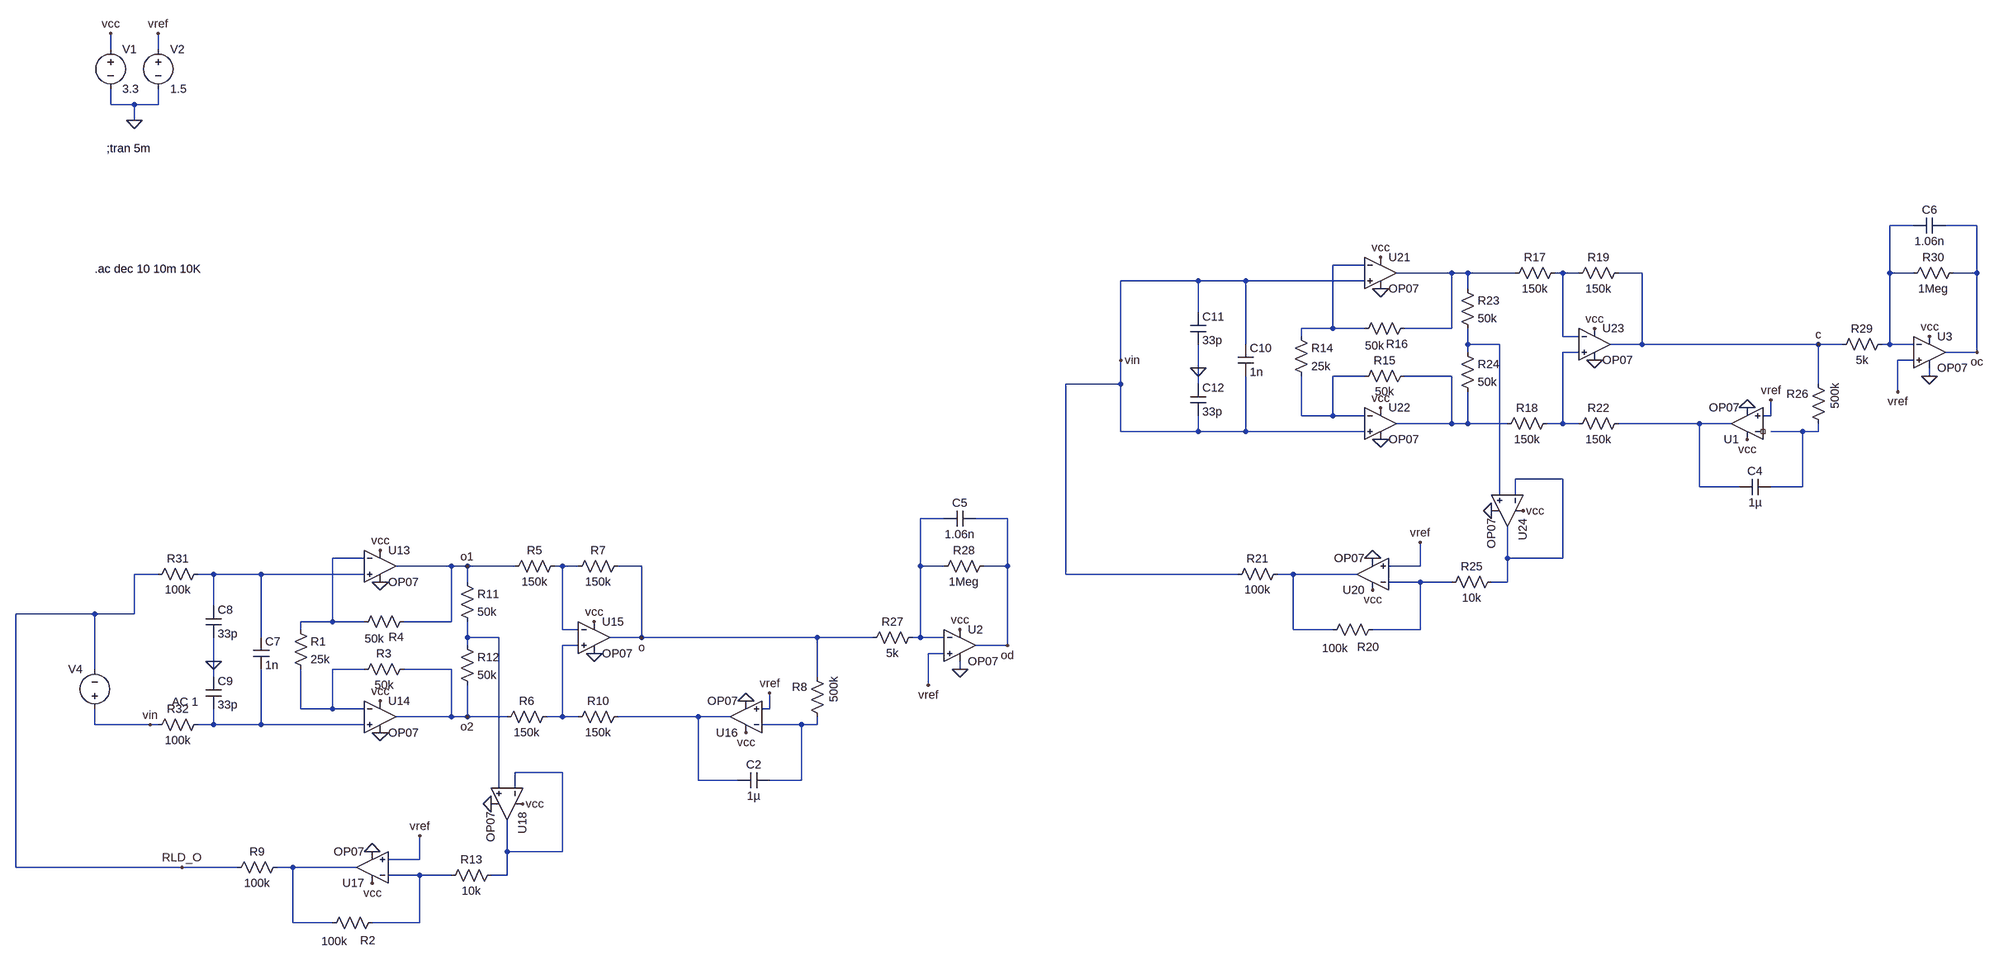
[diagram p0: schematic CMRR - Copy.asc]
CMRR - Copy.asc, the LTspice schematic file:
Version 4
SHEET 1 3136 1104
WIRE -1280 -1120 -1280 -1152
WIRE -1184 -1120 -1184 -1152
WIRE -1280 -1008 -1280 -1040
WIRE -1232 -1008 -1280 -1008
WIRE -1184 -1008 -1184 -1040
WIRE -1184 -1008 -1232 -1008
WIRE -1232 -976 -1232 -1008
WIRE 2976 -624 2928 -624
WIRE 3104 -624 3040 -624
WIRE 1808 -544 1744 -544
WIRE 1984 -528 1872 -528
WIRE 2016 -528 1984 -528
WIRE 2112 -528 2016 -528
WIRE 2208 -528 2192 -528
WIRE 2240 -528 2208 -528
WIRE 2368 -528 2320 -528
WIRE 2928 -528 2928 -624
WIRE 2976 -528 2928 -528
WIRE 3104 -528 3104 -624
WIRE 3104 -528 3056 -528
WIRE 1472 -512 1264 -512
WIRE 1568 -512 1472 -512
WIRE 1808 -512 1568 -512
WIRE 2016 -496 2016 -528
WIRE 1472 -448 1472 -512
WIRE 1744 -416 1744 -544
WIRE 1744 -416 1680 -416
WIRE 1808 -416 1744 -416
WIRE 1984 -416 1984 -528
WIRE 1984 -416 1888 -416
WIRE 1680 -400 1680 -416
WIRE 2208 -400 2208 -528
WIRE 2240 -400 2208 -400
WIRE 1568 -384 1568 -512
WIRE 2016 -384 2016 -416
WIRE 2080 -384 2016 -384
WIRE 2368 -384 2368 -528
WIRE 2368 -384 2304 -384
WIRE 2784 -384 2368 -384
WIRE 2832 -384 2784 -384
WIRE 2928 -384 2928 -528
WIRE 2928 -384 2912 -384
WIRE 2976 -384 2928 -384
WIRE 2016 -368 2016 -384
WIRE 2240 -368 2208 -368
WIRE 3104 -368 3104 -528
WIRE 3104 -368 3040 -368
WIRE 1264 -352 1264 -512
WIRE 2976 -352 2944 -352
WIRE 1472 -336 1472 -384
WIRE 1808 -320 1744 -320
WIRE 1984 -320 1888 -320
WIRE 3008 -320 3008 -336
WIRE 1264 -304 1264 -352
WIRE 1264 -304 1088 -304
WIRE 1472 -304 1472 -336
WIRE 2784 -304 2784 -384
WIRE 2944 -288 2944 -352
WIRE 1680 -240 1680 -320
WIRE 1744 -240 1744 -320
WIRE 1744 -240 1680 -240
WIRE 1808 -240 1744 -240
WIRE 2688 -240 2688 -272
WIRE 2688 -240 2672 -240
WIRE 1984 -224 1984 -320
WIRE 1984 -224 1872 -224
WIRE 2016 -224 2016 -288
WIRE 2016 -224 1984 -224
WIRE 2096 -224 2016 -224
WIRE 2208 -224 2208 -368
WIRE 2208 -224 2176 -224
WIRE 2240 -224 2208 -224
WIRE 2544 -224 2320 -224
WIRE 2608 -224 2544 -224
WIRE 1264 -208 1264 -304
WIRE 1472 -208 1472 -240
WIRE 1472 -208 1264 -208
WIRE 1568 -208 1568 -320
WIRE 1568 -208 1472 -208
WIRE 1808 -208 1568 -208
WIRE 2752 -208 2688 -208
WIRE 2784 -208 2784 -224
WIRE 2784 -208 2752 -208
WIRE 2208 -112 2112 -112
WIRE 2544 -96 2544 -224
WIRE 2624 -96 2544 -96
WIRE 2752 -96 2752 -208
WIRE 2752 -96 2688 -96
WIRE 2080 -80 2080 -384
WIRE 2112 -80 2112 -112
WIRE 464 -32 416 -32
WIRE 592 -32 528 -32
WIRE -768 48 -832 48
WIRE 2096 48 2096 -16
WIRE 2208 48 2208 -112
WIRE 2208 48 2096 48
WIRE -592 64 -704 64
WIRE -560 64 -592 64
WIRE -464 64 -560 64
WIRE -368 64 -384 64
WIRE -336 64 -368 64
WIRE -208 64 -256 64
WIRE 416 64 416 -32
WIRE 464 64 416 64
WIRE 592 64 592 -32
WIRE 592 64 544 64
WIRE 1920 64 1920 16
WIRE 1920 64 1856 64
WIRE -1184 80 -1232 80
WIRE -1072 80 -1104 80
WIRE -976 80 -1072 80
WIRE -768 80 -976 80
WIRE 1088 80 1088 -304
WIRE 1552 80 1088 80
WIRE 1664 80 1632 80
WIRE 1792 80 1664 80
WIRE -560 96 -560 64
WIRE 1920 96 1856 96
WIRE 1984 96 1920 96
WIRE 2096 96 2096 48
WIRE 2096 96 2064 96
WIRE -1072 144 -1072 80
WIRE -1312 160 -1488 160
WIRE -1232 160 -1232 80
WIRE -1232 160 -1312 160
WIRE -832 176 -832 48
WIRE -832 176 -896 176
WIRE -768 176 -832 176
WIRE -592 176 -592 64
WIRE -592 176 -688 176
WIRE -896 192 -896 176
WIRE -368 192 -368 64
WIRE -336 192 -368 192
WIRE 1664 192 1664 80
WIRE 1744 192 1664 192
WIRE 1920 192 1920 96
WIRE 1920 192 1824 192
WIRE -976 208 -976 80
WIRE -560 208 -560 176
WIRE -496 208 -560 208
WIRE -208 208 -208 64
WIRE -208 208 -272 208
WIRE 208 208 -208 208
WIRE 320 208 208 208
WIRE 416 208 416 64
WIRE 416 208 400 208
WIRE 464 208 416 208
WIRE -560 224 -560 208
WIRE -336 224 -368 224
WIRE 592 224 592 64
WIRE 592 224 528 224
WIRE 464 240 432 240
WIRE -1072 256 -1072 208
WIRE -1312 272 -1312 160
WIRE -768 272 -832 272
WIRE -592 272 -688 272
WIRE 496 272 496 256
WIRE -1072 288 -1072 256
WIRE 208 288 208 208
WIRE 432 304 432 240
WIRE -896 352 -896 272
WIRE -832 352 -832 272
WIRE -832 352 -896 352
WIRE -768 352 -832 352
WIRE 112 352 112 320
WIRE 112 352 96 352
WIRE -592 368 -592 272
WIRE -592 368 -704 368
WIRE -560 368 -560 304
WIRE -560 368 -592 368
WIRE -480 368 -560 368
WIRE -368 368 -368 224
WIRE -368 368 -400 368
WIRE -336 368 -368 368
WIRE -32 368 -256 368
WIRE 32 368 -32 368
WIRE -1312 384 -1312 352
WIRE -1200 384 -1312 384
WIRE -1184 384 -1200 384
WIRE -1072 384 -1072 352
WIRE -1072 384 -1104 384
WIRE -976 384 -976 272
WIRE -976 384 -1072 384
WIRE -768 384 -976 384
WIRE 176 384 96 384
WIRE 208 384 208 368
WIRE 208 384 176 384
WIRE -368 480 -464 480
WIRE -32 496 -32 368
WIRE 48 496 -32 496
WIRE 176 496 176 384
WIRE 176 496 112 496
WIRE -496 512 -496 208
WIRE -464 512 -464 480
WIRE -480 640 -480 576
WIRE -368 640 -368 480
WIRE -368 640 -480 640
WIRE -656 656 -656 608
WIRE -656 656 -720 656
WIRE -1488 672 -1488 160
WIRE -1136 672 -1488 672
WIRE -1024 672 -1136 672
WIRE -912 672 -944 672
WIRE -784 672 -912 672
WIRE -656 688 -720 688
WIRE -592 688 -656 688
WIRE -480 688 -480 640
WIRE -480 688 -512 688
WIRE -912 784 -912 672
WIRE -832 784 -912 784
WIRE -656 784 -656 688
WIRE -656 784 -752 784
FLAG -1232 -976 0
FLAG -1280 -1152 vcc
FLAG -1184 -1152 vref
FLAG -656 608 vref
FLAG -752 640 0
FLAG -736 400 0
FLAG -736 96 0
FLAG -304 240 0
FLAG -736 32 vcc
FLAG -752 704 vcc
FLAG -736 336 vcc
FLAG -304 176 vcc
FLAG -1136 672 RLD_O
FLAG -560 64 o1
FLAG -560 368 o2
FLAG -448 544 vcc
FLAG -512 544 0
FLAG 64 400 vcc
FLAG 64 336 0
FLAG 112 320 vref
FLAG -208 208 o
FLAG 1920 16 vref
FLAG 1824 48 0
FLAG 1840 -192 0
FLAG 1840 -496 0
FLAG 2272 -352 0
FLAG 1840 -560 vcc
FLAG 1824 112 vcc
FLAG 1840 -256 vcc
FLAG 2272 -416 vcc
FLAG 2128 -48 vcc
FLAG 2064 -48 0
FLAG 2640 -192 vcc
FLAG 2640 -256 0
FLAG 2688 -272 vref
FLAG 3104 -368 oc
FLAG 592 224 od
FLAG -1200 384 vin
FLAG 1264 -352 vin
FLAG 496 192 vcc
FLAG 496 272 0
FLAG 432 304 vref
FLAG 3008 -400 vcc
FLAG 3008 -320 0
FLAG 2944 -288 vref
FLAG -1072 256 0
FLAG 1472 -336 0
FLAG 2784 -384 c
SYMBOL res -912 176 R0
SYMATTR InstName R1
SYMATTR Value 25k
SYMBOL res -672 256 R90
WINDOW 0 0 56 VBottom 2
WINDOW 3 32 56 VTop 2
SYMATTR InstName R3
SYMATTR Value 50k
SYMBOL res -672 160 R90
WINDOW 0 63 31 VBottom 2
WINDOW 3 35 76 VTop 2
SYMATTR InstName R4
SYMATTR Value 50k
SYMBOL res -368 48 R90
WINDOW 0 0 56 VBottom 2
WINDOW 3 32 56 VTop 2
SYMATTR InstName R5
SYMATTR Value 150k
SYMBOL res -384 352 R90
WINDOW 0 0 56 VBottom 2
WINDOW 3 32 56 VTop 2
SYMATTR InstName R6
SYMATTR Value 150k
SYMBOL res -240 48 R90
WINDOW 0 0 56 VBottom 2
WINDOW 3 32 56 VTop 2
SYMATTR InstName R7
SYMATTR Value 150k
SYMBOL res -736 768 R90
WINDOW 0 67 25 VBottom 2
WINDOW 3 38 92 VTop 2
SYMATTR InstName R2
SYMATTR Value 100k
SYMBOL res -928 656 R90
WINDOW 0 0 56 VBottom 2
WINDOW 3 32 56 VTop 2
SYMATTR InstName R9
SYMATTR Value 100k
SYMBOL res -240 352 R90
WINDOW 0 0 56 VBottom 2
WINDOW 3 32 56 VTop 2
SYMATTR InstName R10
SYMATTR Value 150k
SYMBOL voltage -1280 -1136 R0
WINDOW 123 0 0 Left 0
WINDOW 39 0 0 Left 0
SYMATTR InstName V1
SYMATTR Value 3.3
SYMBOL voltage -1184 -1136 R0
WINDOW 123 0 0 Left 0
WINDOW 39 0 0 Left 0
SYMATTR InstName V2
SYMATTR Value 1.5
SYMBOL voltage -1312 368 R180
WINDOW 0 24 96 Left 2
WINDOW 3 -209 58 Left 2
WINDOW 123 -209 30 Left 2
WINDOW 39 0 0 Left 0
SYMATTR InstName V4
SYMATTR Value ""
SYMATTR Value2 AC 1
SYMBOL res -576 80 R0
SYMATTR InstName R11
SYMATTR Value 50k
SYMBOL res -576 208 R0
SYMATTR InstName R12
SYMATTR Value 50k
SYMBOL res -496 672 R90
WINDOW 0 0 56 VBottom 2
WINDOW 3 32 56 VTop 2
SYMATTR InstName R13
SYMATTR Value 10k
SYMBOL res 224 384 R180
WINDOW 0 36 76 Left 2
WINDOW 3 -18 98 VLeft 2
SYMATTR InstName R8
SYMATTR Value 500k
SYMBOL cap 112 480 R90
WINDOW 0 0 32 VBottom 2
WINDOW 3 32 32 VTop 2
SYMATTR InstName C2
SYMATTR Value 1µ
SYMBOL res 1664 -416 R0
SYMATTR InstName R14
SYMATTR Value 25k
SYMBOL res 1904 -336 R90
WINDOW 0 0 56 VBottom 2
WINDOW 3 32 56 VTop 2
SYMATTR InstName R15
SYMATTR Value 50k
SYMBOL res 1904 -432 R90
WINDOW 0 63 31 VBottom 2
WINDOW 3 35 76 VTop 2
SYMATTR InstName R16
SYMATTR Value 50k
SYMBOL res 2208 -544 R90
WINDOW 0 0 56 VBottom 2
WINDOW 3 32 56 VTop 2
SYMATTR InstName R17
SYMATTR Value 150k
SYMBOL res 2192 -240 R90
WINDOW 0 0 56 VBottom 2
WINDOW 3 32 56 VTop 2
SYMATTR InstName R18
SYMATTR Value 150k
SYMBOL res 2336 -544 R90
WINDOW 0 0 56 VBottom 2
WINDOW 3 32 56 VTop 2
SYMATTR InstName R19
SYMATTR Value 150k
SYMBOL res 1840 176 R90
WINDOW 0 67 25 VBottom 2
WINDOW 3 38 92 VTop 2
SYMATTR InstName R20
SYMATTR Value 100k
SYMBOL res 1648 64 R90
WINDOW 0 0 56 VBottom 2
WINDOW 3 32 56 VTop 2
SYMATTR InstName R21
SYMATTR Value 100k
SYMBOL res 2336 -240 R90
WINDOW 0 0 56 VBottom 2
WINDOW 3 32 56 VTop 2
SYMATTR InstName R22
SYMATTR Value 150k
SYMBOL res 2000 -512 R0
SYMATTR InstName R23
SYMATTR Value 50k
SYMBOL res 2000 -384 R0
SYMATTR InstName R24
SYMATTR Value 50k
SYMBOL res 2080 80 R90
WINDOW 0 0 56 VBottom 2
WINDOW 3 32 56 VTop 2
SYMATTR InstName R25
SYMATTR Value 10k
SYMBOL res 2800 -208 R180
WINDOW 0 36 76 Left 2
WINDOW 3 -18 98 VLeft 2
SYMATTR InstName R26
SYMATTR Value 500k
SYMBOL cap 2688 -112 R90
WINDOW 0 0 32 VBottom 2
WINDOW 3 32 32 VTop 2
SYMATTR InstName C4
SYMATTR Value 1µ
SYMBOL OpAmps\\OP07 -736 0 R0
SYMATTR InstName U13
SYMBOL OpAmps\\OP07 -736 304 R0
SYMATTR InstName U14
SYMBOL OpAmps\\OP07 -304 144 R0
SYMATTR InstName U15
SYMBOL OpAmps\\OP07 64 432 R180
SYMATTR InstName U16
SYMBOL OpAmps\\OP07 -752 736 R180
SYMATTR InstName U17
SYMBOL OpAmps\\OP07 -416 544 R90
SYMATTR InstName U18
SYMBOL OpAmps\\OP07 1824 144 R180
SYMATTR InstName U20
SYMBOL OpAmps\\OP07 1840 -592 R0
SYMATTR InstName U21
SYMBOL OpAmps\\OP07 1840 -288 R0
SYMATTR InstName U22
SYMBOL OpAmps\\OP07 2272 -448 R0
SYMATTR InstName U23
SYMBOL OpAmps\\OP07 2160 -48 R90
SYMATTR InstName U24
SYMBOL OpAmps\\OP07 2640 -160 R180
SYMATTR InstName U1
SYMBOL OpAmps\\OP07 496 160 R0
SYMATTR InstName U2
SYMBOL res 416 192 R90
WINDOW 0 0 56 VBottom 2
WINDOW 3 32 56 VTop 2
SYMATTR InstName R27
SYMATTR Value 5k
SYMBOL res 560 48 R90
WINDOW 0 0 56 VBottom 2
WINDOW 3 32 56 VTop 2
SYMATTR InstName R28
SYMATTR Value 1Meg
SYMBOL cap 528 -48 R90
WINDOW 0 0 32 VBottom 2
WINDOW 3 32 32 VTop 2
SYMATTR InstName C5
SYMATTR Value 1.06n
SYMBOL OpAmps\\OP07 3008 -432 R0
SYMATTR InstName U3
SYMBOL res 2928 -400 R90
WINDOW 0 0 56 VBottom 2
WINDOW 3 32 56 VTop 2
SYMATTR InstName R29
SYMATTR Value 5k
SYMBOL res 3072 -544 R90
WINDOW 0 0 56 VBottom 2
WINDOW 3 32 56 VTop 2
SYMATTR InstName R30
SYMATTR Value 1Meg
SYMBOL cap 3040 -640 R90
WINDOW 0 0 32 VBottom 2
WINDOW 3 32 32 VTop 2
SYMATTR InstName C6
SYMATTR Value 1.06n
SYMBOL cap -992 208 R0
SYMATTR InstName C7
SYMATTR Value 1n
SYMBOL cap -1088 144 R0
SYMATTR InstName C8
SYMATTR Value 33p
SYMBOL cap -1088 288 R0
SYMATTR InstName C9
SYMATTR Value 33p
SYMBOL res -1088 64 R90
WINDOW 0 0 56 VBottom 2
WINDOW 3 32 56 VTop 2
SYMATTR InstName R31
SYMATTR Value 100k
SYMBOL res -1088 368 R90
WINDOW 0 0 56 VBottom 2
WINDOW 3 32 56 VTop 2
SYMATTR InstName R32
SYMATTR Value 100k
SYMBOL cap 1552 -384 R0
SYMATTR InstName C10
SYMATTR Value 1n
SYMBOL cap 1456 -448 R0
SYMATTR InstName C11
SYMATTR Value 33p
SYMBOL cap 1456 -304 R0
SYMATTR InstName C12
SYMATTR Value 33p
TEXT -1288 -920 Left 2 !;tran 5m
TEXT -1312 -536 Left 2 !.ac dec 10 10m 10K

The netlist it stands for:
* CMRR - Copy.asc
R1 N013 N020 25k
R3 o2 N020 50k
R4 o1 N013 50k
R5 N014 o1 150k
R6 N019 o2 150k
R7 o N014 150k
R2 N026 N025 100k
R9 N025 RLD_O 100k
R10 N021 N019 150k
V1 vcc 0 3.3
V2 vref 0 1.5
V4 vin RLD_O AC 1
R11 o1 N018 50k
R12 N018 o2 50k
R13 N024 N026 10k
R8 N023 o 500k
C2 N023 N021 1µ
R14 N002 N007 25k
R15 N008 N007 50k
R16 N003 N002 50k
R17 N004 N003 150k
R18 N006 N008 150k
R19 c N004 150k
R20 N017 N016 100k
R21 N016 vin 100k
R22 N009 N006 150k
R23 N003 N005 50k
R24 N005 N008 50k
R25 N011 N017 10k
R26 N010 c 500k
C4 N010 N009 1µ
XU13 N015 N013 vcc 0 o1 LT1001  ; OP07, pins In+ In- V+ V- OUT
XU14 N022 N020 vcc 0 o2 LT1001  ; OP07, pins In+ In- V+ V- OUT
XU15 N019 N014 vcc 0 o LT1001  ; OP07, pins In+ In- V+ V- OUT
XU16 vref N023 vcc 0 N021 LT1001  ; OP07, pins In+ In- V+ V- OUT
XU17 vref N026 vcc 0 N025 LT1001  ; OP07, pins In+ In- V+ V- OUT
XU18 N018 N024 vcc 0 N024 LT1001  ; OP07, pins In+ In- V+ V- OUT
XU20 vref N017 vcc 0 N016 LT1001  ; OP07, pins In+ In- V+ V- OUT
XU21 vin N002 vcc 0 N003 LT1001  ; OP07, pins In+ In- V+ V- OUT
XU22 vin N007 vcc 0 N008 LT1001  ; OP07, pins In+ In- V+ V- OUT
XU23 N006 N004 vcc 0 c LT1001  ; OP07, pins In+ In- V+ V- OUT
XU24 N005 N011 vcc 0 N011 LT1001  ; OP07, pins In+ In- V+ V- OUT
XU1 vref NC_01 vcc 0 N009 LT1001  ; OP07, pins In+ In- V+ V- OUT
XU2 vref N012 vcc 0 od LT1001  ; OP07, pins In+ In- V+ V- OUT
R27 N012 o 5k
R28 od N012 1Meg
C5 od N012 1.06n
XU3 vref N001 vcc 0 oc LT1001  ; OP07, pins In+ In- V+ V- OUT
R29 N001 c 5k
R30 oc N001 1Meg
C6 oc N001 1.06n
C7 N015 N022 1n
C8 N015 0 33p
C9 0 N022 33p
R31 N015 RLD_O 100k
R32 N022 vin 100k
C10 vin vin 1n
C11 vin 0 33p
C12 0 vin 33p
;tran 5m
.ac dec 10 10m 10K
.lib LTC.lib
.backanno
.end